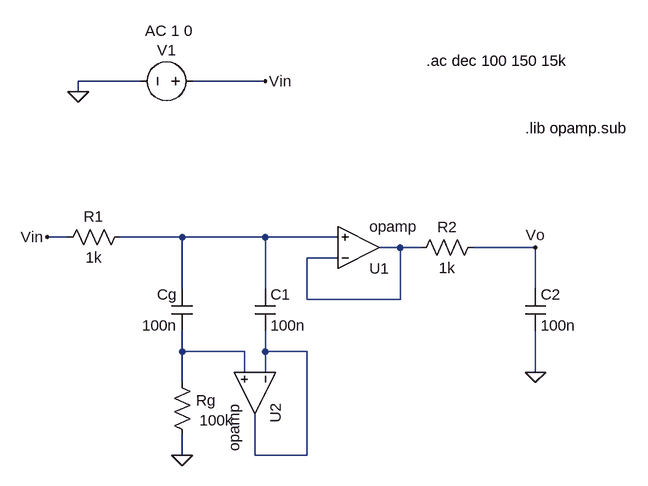
[diagram p0: schematic Circuito_Girador.asc]
Circuito_Girador.asc, the LTspice schematic file:
Version 4
SHEET 1 880 680
WIRE -160 -128 -256 -128
WIRE 32 -128 -80 -128
WIRE -256 -112 -256 -128
WIRE -272 112 -304 112
WIRE -96 112 -192 112
WIRE 32 112 -96 112
WIRE 144 112 32 112
WIRE 240 128 208 128
WIRE 272 128 240 128
WIRE 448 128 352 128
WIRE 144 144 96 144
WIRE -96 192 -96 112
WIRE 32 192 32 112
WIRE 448 192 448 128
WIRE 96 208 96 144
WIRE 240 208 240 128
WIRE 240 208 96 208
WIRE -96 288 -96 256
WIRE 0 288 -96 288
WIRE 32 288 32 256
WIRE 96 288 32 288
WIRE 0 320 0 288
WIRE 32 320 32 288
WIRE 448 320 448 256
WIRE -96 336 -96 288
WIRE -96 448 -96 416
WIRE 16 448 16 384
WIRE 96 448 96 288
WIRE 96 448 16 448
FLAG 448 320 0
FLAG -304 112 Vin
FLAG 448 128 Vo
FLAG -256 -112 0
FLAG 32 -128 Vin
FLAG -96 448 0
SYMBOL OpAmps\\opamp 176 192 M180
SYMATTR InstName U1
SYMBOL res -176 96 R90
WINDOW 0 0 56 VBottom 2
WINDOW 3 32 56 VTop 2
SYMATTR InstName R1
SYMATTR Value 1k
SYMBOL res 368 112 R90
WINDOW 0 0 56 VBottom 2
WINDOW 3 32 56 VTop 2
SYMATTR InstName R2
SYMATTR Value 1k
SYMBOL cap 16 192 R0
SYMATTR InstName C1
SYMATTR Value 100n
SYMBOL cap 432 192 R0
SYMATTR InstName C2
SYMATTR Value 100n
SYMBOL voltage -64 -128 R90
WINDOW 0 -32 56 VBottom 2
WINDOW 3 32 56 VTop 2
WINDOW 123 -62 52 VBottom 2
WINDOW 39 0 0 Left 0
SYMATTR InstName V1
SYMATTR Value ""
SYMATTR Value2 AC 1 0
SYMBOL OpAmps\\opamp 80 352 R90
SYMATTR InstName U2
SYMBOL cap -80 256 R180
WINDOW 0 24 56 Left 2
WINDOW 3 24 8 Left 2
SYMATTR InstName Cg
SYMATTR Value 100n
SYMBOL res -80 432 R180
WINDOW 0 -36 69 Left 2
WINDOW 3 -63 38 Left 2
SYMATTR InstName Rg
SYMATTR Value 100k
TEXT 432 -56 Left 2 !.lib opamp.sub
TEXT 280 -160 Left 2 !.ac dec 100 150 15k

The netlist it stands for:
* Circuito_Girador.asc
XU1 N002 N001 N002 opamp Aol=100K GBW=10Meg  ; pins invin noninvin out
R1 N001 Vin 1k
R2 Vo N002 1k
C1 N001 N004 100n
C2 Vo 0 100n
V1 Vin 0 AC 1 0
XU2 N004 N003 N004 opamp Aol=100K GBW=10Meg  ; pins invin noninvin out
Cg N003 N001 100n
Rg 0 N003 100k
.lib opamp.sub
.ac dec 100 150 15k
.backanno
.end

* Results of the author's LTspice run, read from the files saved beside the schematic
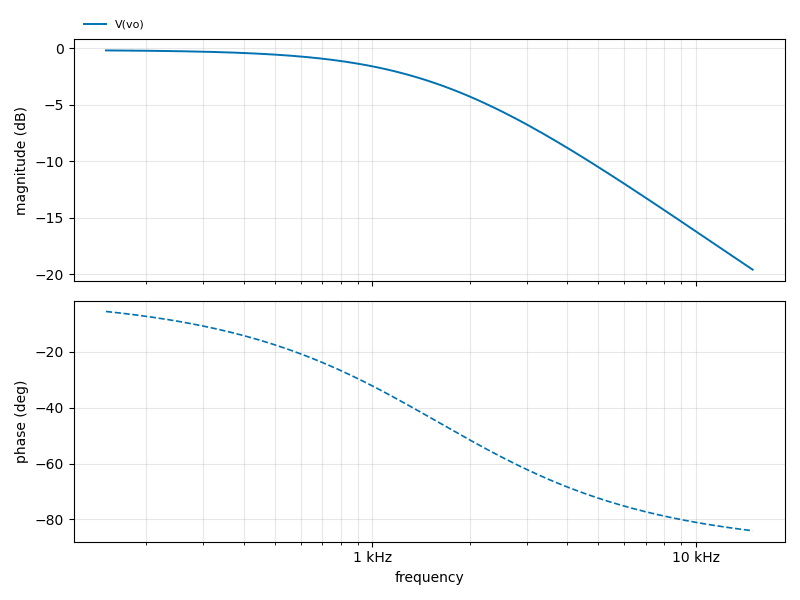
[diagram p1: AC Analysis of Circuito_Girador.asc, plotted from the saved traces]
* AC Analysis, 1 run:
*   V(vo): -0.21 dB at 150 Hz, -19.58 dB at 15 kHz, peak -0.21 dB at 150 Hz, 3 dB below the peak at 1.605 kHz